# Altium schematic sheet POWERSYSTEM.SchDoc: DARKYDEN_POWERSYSTEM
size Letter; ApprovedBy: APPROUVÉ PAR; Author: Harold Malbrouck; Organization: Cegep Limoilou; Address1: 1300, 8e Avenue; Address2: Québec, QC; Address3: Canada; Address4: G1J 5L5; Revision: Rev.A; SheetNumber: 16; SheetTotal: 22
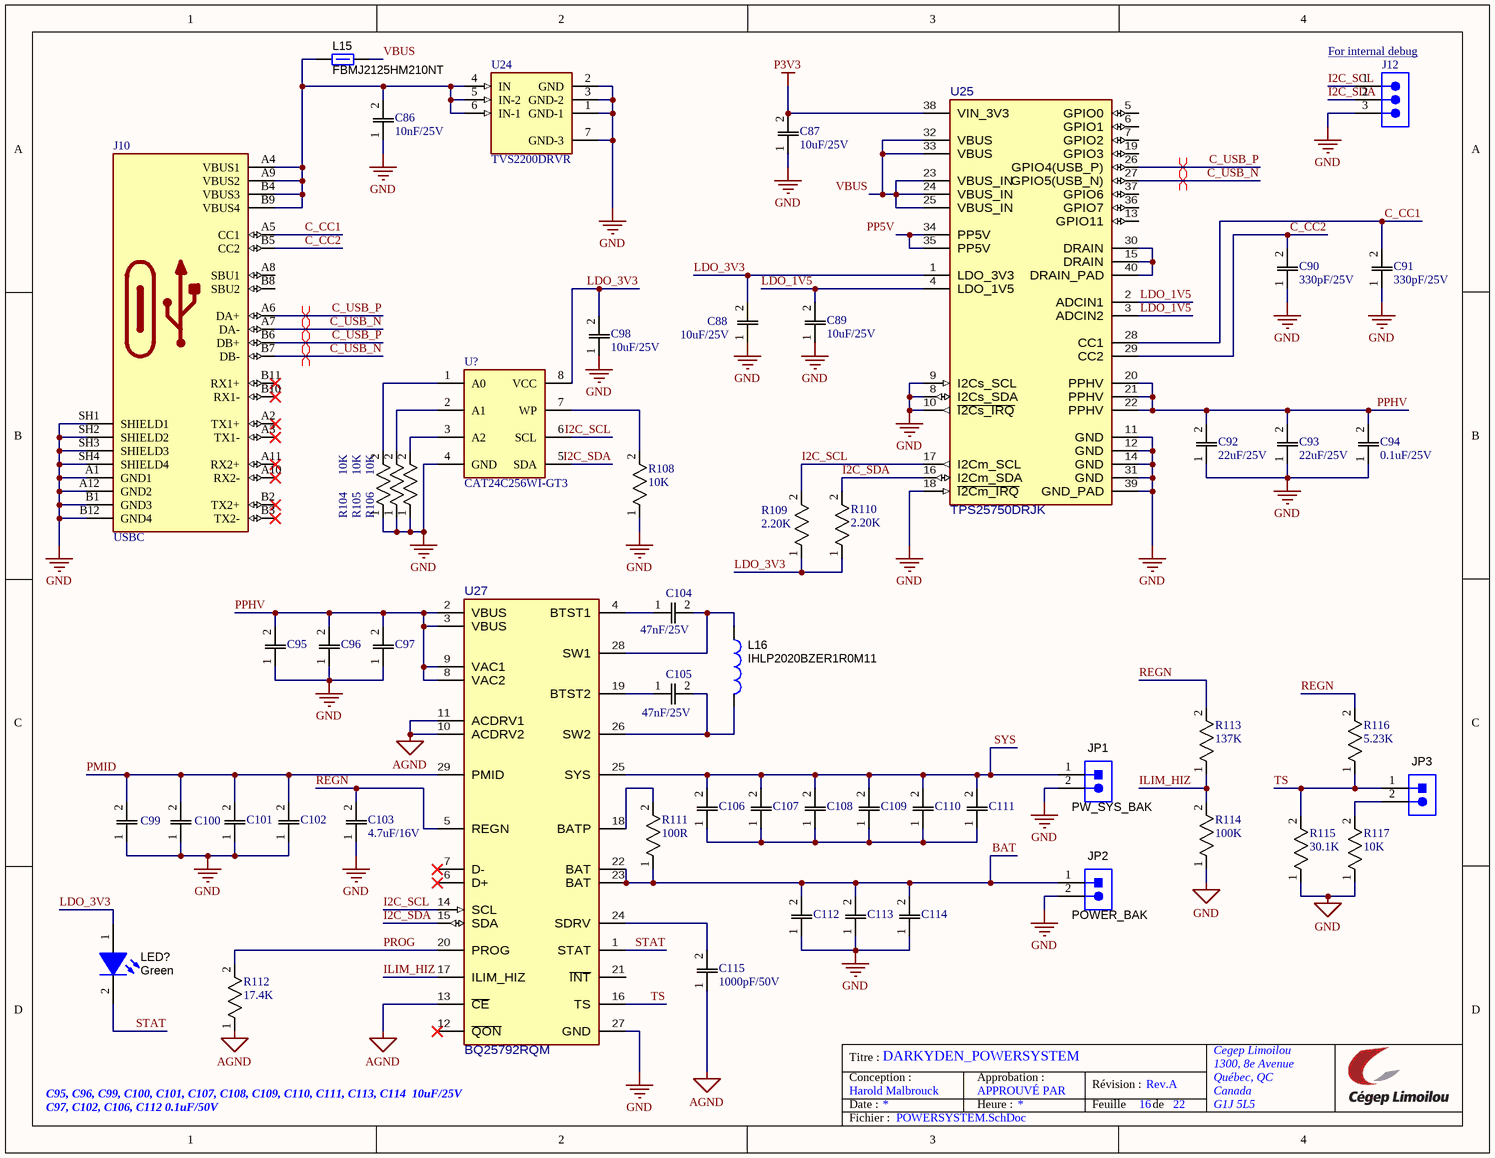
[diagram p0: POWERSYSTEM.SchDoc]

## Parts
C86  10nF/25V  [CAPC220145_88N_KEM]
C87  10uF/25V  [CAPC220145_88N_KEM]
C88  10uF/25V  [CAPC220145_88N_KEM]
C89  10uF/25V  [CAPC220145_88N_KEM]
C90  330pF/25V  [CAPC220145_88N_KEM]
C91  330pF/25V  [CAPC220145_88N_KEM]
C92  22uF/25V  [CAPC220145_88N_KEM]
C93  22uF/25V  [CAPC220145_88N_KEM]
C94  0.1uF/25V  [CAPC220145_88N_KEM]
C95  10uF/25V  [CAPC220145_88N_KEM]  (value not drawn)
C96  10uF/25V  [CAPC220145_88N_KEM]  (value not drawn)
C97  0.1uF/50V  [CAPC220145_88N_KEM]  (value not drawn)
C98  10uF/25V  [CAPC220145_88N_KEM]
C99  10uF/25V  [CAPC220145_88N_KEM]  (value not drawn)
C100  10uF/25V  [CAPC220145_88N_KEM]  (value not drawn)
C101  10uF/25V  [CAPC220145_88N_KEM]  (value not drawn)
C102  0.1uF/50V  [CAPC220145_88N_KEM]  (value not drawn)
C103  4.7uF/16V  [CAPC220145_88N_KEM]
C104  47nF/25V  [CAPC220145_88N_KEM]
C105  47nF/25V  [CAPC220145_88N_KEM]
C106  0.1uF/50V  [CAPC220145_88N_KEM]  (value not drawn)
C107  10uF/25V  [CAPC220145_88N_KEM]  (value not drawn)
C108  10uF/25V  [CAPC220145_88N_KEM]  (value not drawn)
C109  10uF/25V  [CAPC220145_88N_KEM]  (value not drawn)
C110  10uF/25V  [CAPC220145_88N_KEM]  (value not drawn)
C111  10uF/25V  [CAPC220145_88N_KEM]  (value not drawn)
C112  0.1uF/50V  [CAPC220145_88N_KEM]  (value not drawn)
C113  10uF/25V  [CAPC220145_88N_KEM]  (value not drawn)
C114  10uF/25V  [CAPC220145_88N_KEM]  (value not drawn)
C115  1000pF/50V  [CAPC220145_88N_KEM]
J10  USBC  [MOLEX_2012670005]
J12  61300311121  [61300311121]  (value not drawn)
JP1  PW_SYS_BAK  [61300211121]
JP2  POWER_BAK  [61300211121]
JP3  TS  [61300211121]  (value not drawn)
L15  FBMJ2125HM210NT  [0805_HV]
L16  IHLP2020BZER1R0M11  [IHLP-2020BZ]
LED?  value Green  [LED_LTST-C190]  (hidden comment: LTST-C190GKT)
R104  10K  [RES_0816_SUS]
R105  10K  [RES_0816_SUS]
R106  10K  [RES_0816_SUS]
R108  10K  [RES_0816_SUS]
R109  2.20K  [RES_0816_SUS]
R110  2.20K  [RES_0816_SUS]
R111  100R  [RES_0816_SUS]
R112  17.4K  [RES_0816_SUS]
R113  137K  [RES_0816_SUS]
R114  100K  [RES_0816_SUS]
R115  30.1K  [RES_0816_SUS]
R116  5.23K  [RES_0816_SUS]
R117  10K  [RES_0816_SUS]
U24  TVS2200DRVR  [SON65P200X200X80-7N]
U25  TPS25750DRJK  [TPS25750DRJKR]
U27  BQ25792RQM  [BQ25792RQMR]
U?  CAT24C256WI-GT3  [SOIC127P600X175-8N]

## Nets
AGND: C115.1 R112.1 U27.10(ACDRV2) U27.11(ACDRV1) U27.13(~{CE})
GND: C86.1 C87.1 C88.1 C89.1 C90.1 C91.1 C92.1 C93.1 C94.1 C95.1 C96.1 C97.1 C98.1 C99.1 C100.1 C101.1 C102.1 C103.1 C112.1 C113.1 C114.1 J10.A1(GND1) J10.A12(GND2) J10.B1(GND3) J10.B12(GND4) J10.SH1(SHIELD1) J10.SH2(SHIELD2) J10.SH3(SHIELD3) J10.SH4(SHIELD4) J12.3 JP1.2 JP2.2 R104.1 R105.1 R106.1 R108.1 R114.1 R115.1 R117.1 U24.1(GND-1) U24.2(GND) U24.3(GND-2) U24.7(GND-3) U25.8(I2Cs_SDA) U25.9(I2Cs_SCL) U25.10(~{I2Cs_IRQ}) U25.11(GND) U25.12(GND) U25.14(GND) U25.18(~{I2Cm_IRQ}) U25.31(GND) U25.39(GND_PAD) U27.27(GND) U?.4(GND)
P3V3: C87.2 U25.38(VIN_3V3)
BAT: C112.2 C113.2 C114.2 JP2.1 R111.1 U27.22(BAT) U27.23(BAT)
C_CC1: C91.2 J10.A5(CC1) U25.28(CC1)
C_CC2: C90.2 J10.B5(CC2) U25.29(CC2)
C_USB_N: J10.A7(DA-) J10.B7(DB-) U25.27(GPIO5(USB_N))
C_USB_P: J10.A6(DA+) J10.B6(DB+) U25.26(GPIO4(USB_P))
I2C_SCL: J12.1 R109.2 U25.17(I2Cm_SCL) U27.14(SCL) U?.6(SCL)
I2C_SDA: J12.2 R110.2 U25.16(I2Cm_SDA) U27.15(SDA) U?.5(SDA)
ILIM_HIZ: R113.1 R114.2 U27.17(ILIM_HIZ)
LDO_1V5: C89.2 U25.2(ADCIN1) U25.3(ADCIN2) U25.4(LDO_1V5)
LDO_3V3: C88.2 C98.2 LED?.1(A) R109.1 R110.1 U25.1(LDO_3V3) U?.8(VCC)
PMID: C99.2 C100.2 C101.2 C102.2 U27.29(PMID)
PP5V: U25.34(PP5V) U25.35(PP5V)
PPHV: C92.2 C93.2 C94.2 C95.2 C96.2 C97.2 U25.20(PPHV) U25.21(PPHV) U25.22(PPHV) U27.2(VBUS) U27.3(VBUS) U27.8(VAC2) U27.9(VAC1)
PROG: R112.2 U27.20(PROG)
REGN: C103.2 R113.2 R116.2 U27.5(REGN)
STAT: LED?.2(K) U27.1(STAT)
SYS: C106.2 C107.2 C108.2 C109.2 C110.2 C111.2 JP1.1 U27.25(SYS)
TS: JP3.1 R115.2 R116.1 U27.16(TS)
VBUS: L15.2 U25.23(VBUS_IN) U25.24(VBUS_IN) U25.25(VBUS_IN) U25.32(VBUS) U25.33(VBUS)
NetC86_2: C86.2 J10.A4(VBUS1) J10.A9(VBUS2) J10.B4(VBUS3) J10.B9(VBUS4) L15.1 U24.4(IN) U24.5(IN-2) U24.6(IN-1)
NetC104_1: C104.1 U27.4(BTST1)
NetC104_2: C104.2 L16.1 U27.28(SW1)
NetC105_1: C105.1 U27.19(BTST2)
NetC105_2: C105.2 L16.2 U27.26(SW2)
NetC106_1: C106.1 C107.1 C108.1 C109.1 C110.1 C111.1
NetC115_2: C115.2 U27.24(SDRV)
NetJP3_2: JP3.2 R117.2
NetR104_2: R104.2 U?.1(A0)
NetR105_2: R105.2 U?.2(A1)
NetR106_2: R106.2 U?.3(A2)
NetR108_2: R108.2 U?.7(WP)
NetR111_2: R111.2 U27.18(BATP)
NetU25_15: U25.15(DRAIN) U25.30(DRAIN) U25.40(DRAIN_PAD)

Not connected (* = marked no-connect by the designer): J10 A2(TX1+)* A3(TX1-)* A8(SBU1) A10(RX2-)* A11(RX2+)* B2(TX2+)* B3(TX2-)* B8(SBU2) B10(RX1-)* B11(RX1+)*; U25 5(GPIO0) 6(GPIO1) 7(GPIO2) 13(GPIO11) 19(GPIO3) 36(GPIO7) 37(GPIO6); U27 6(D+)* 7(D-)* 12(~{QON})* 21(~{INT})

## Layout directives
differential pair: C_USB_N, C_USB_P

## Notes on the sheet
- (near J12) For internal debug
- C95, C96, C99, C100, C101, C107, C108, C109, C110, C111, C113, C114  10uF/25V
  C97, C102, C106, C112 0.1uF/50V
- Titre :
- Conception :
- Date :
- Approbation :
- Heure :
- Révision :
- Feuille
- de
- Fichier :

## Library data of the parts
C86-C115 = Capacitor_0805: No Description Available; Mfr_Name: Yageo
J10 = USBC: USB-C (USB TYPE-C) USB 3.2 Gen 2 (USB 3.1 Gen 2, Superspeed + (USB 3.1)) Receptacle Connector 24 Position Surface Mount, Right Angle; Through Hole; MF: Molex; MP: 2012670005; SnapEDA_Link: https://www.snapeda.com/parts/2012670005/Molex/view-part/?ref=snap; Package: None; Value: *; Check_prices: https://www.snapeda.com/parts/2012670005/Molex/view-part/?ref=eda
J12 = 61300311121: WR-PHD Pin Header, THT, Vertical, pitch 2.54mm, 1 Row, 3P; Manufacturer: Wurth Elektronik; Contact Resistance: 20mOhm; Rated Current: 3A; Working Voltage: 250V; Withstanding Voltage: 500V; Manufacturer Part Number: 61300311121; Category: Board-to-Board Connectors; Match Code: WR-PHD; ComponentLink1Description: Website Link; ComponentLink1URL: https://www.we-online.com/redexpert/article/61300311121?ad; ComponentLink2Description: Datasheet Link; ComponentLink2URL: https://www.we-online.com/redexpert/spec/61300311121?ad; Mount: Through Hole; Operating Temperature Max: 105°C; Operating Temperature Min: -40°C; Packaging: Bag; Gender: Pin Header; Number of Pins: 3; Number of Rows: 1; Orientation: Vertical; Pitch: 2.54mm
JP1-JP3 = Header_2x1: Header, 100mil, 2x1, Tin, TH; PartNumber: PEC02SAAN; Manufacturer: Sullins Connector Solutions; Pitch_mm: 2.54; Gender: Male; Shrouded: N; Row_Count: 1; Current_A: 3A; Voltage_V: 1.8kV; Cert_UL: Y; CNHeader: TRUE; CT: FALSE; Green_Lifecycle: Not Set; Green_REACh: Incomplete; PackageReference: Header, 2 PIN, 100mil, Tin; CompType: Header; RoHS: Y; MountType: TH; ComponentLink1Description: Datasheet URL; ComponentLink1URL: http://www.sullinscorp.com/catalogs/77_PAGE108-109_.100_MALE_HDR.pdf; Publisher: Texas Instruments; LatestRevisionDate: 26/05/2017; Supplier 1: Digi-Key; Supplier Part Number 1: S1012E-02-ND; ClassName: Header; Orientation: Vertical; PinCount: 2; ContactFinish: Tin; Color: Black; Green_EU RoHS-2: Incomplete; Green_EU RoHS: Incomplete
L15 = CMP-0003375-1: Ferrite Bead, 21 ohm @ 100 MHz, 6 A, 0805; Manufacturer: Taiyo Yuden; ZTyp@100MHz_Ohm: 21; SizeAreaWB_mm2: 6.75; DCR_ohm: 4m; Value1: 0.004 ohm; Value: 21 ohm; Imax_A: 6A; SizeZ_mm: 1.45; SizeX_mm: 2; SizeY_mm: 1.25; SizeArea_mm2: 2.5; ComponentLink1URL: http://www.yuden.co.jp/us/product/pdf/efbm_e.pdf; Publisher: Texas Instruments; Published: 2014-04-30; RoHS: Y; MountType: SMT; Supplier 1: Digi-Key; PackageReference: 0805; Value2: 6A; CompType: Ferrite Bead; LatestRevisionDate: 2017-03-09; PartNumber: FBMJ2125HM210NT; ComponentLink1Description: Datasheet link; Supplier Part Number 1: 587-1765-1-ND; ValueDisplayed: 21 ohm
L16 = IHLP2020BZER1R0M11: Inductor, Shielded Drum Core, Powdered Iron, 1 uH, 7 A, 0.0181 ohm, SMD; Manufacturer: Vishay-Dale; Isat: 7A @ 20% inductance drop; Irms: 7.5A @ 40C rise; Green_Lifecycle: Active; SizeAreaWB_mm2: 53.7782; DCR_ohm: 0.0181; Green_REACh: Passed; Value: 1uH; Imax_A: 7A; SizeZ_mm: 2; SizeX_mm: 5.49; SizeY_mm: 5.18; SizeArea_mm2: 28.4382; Ind_H: 1µH; AEC Category: Q200; ComponentLink1URL: http://www.vishay.com/docs/34261/lp20bz11.pdf; Publisher: Texas Instruments; Published: 2008-06-26; RoHS: Y; Value1: 0.0181 ohm; Material: Powdered Iron; MountType: SMT; Green_EU RoHS-2: Passed; Supplier 1: Digi-Key; Green_EU RoHS: Passed; PackageReference: 5.49x2x5.18mm; Value2: 7A; CompType: Inductor; LatestRevisionDate: 2017-06-02; PartNumber: IHLP2020BZER1R0M11; AEC Qualified: ?; ComponentLink1Description: Datasheet link; Supplier Part Number 1: 541-1218-1-ND; Technology: Shielded Drum Core
LED? = LED_Gr_SMD: LED, Green, SMD; Manufacturer: Lite-On; Vf_V: 2.1V; Io_A: 20mA; Power_TotalModule: 100mW; Value1: 0.1W; CompType: LED; PartNumber: LTST-C190GKT; MountType: SMT; RoHS: Y; PackageReference: 1.6x0.8x0.8mm; Type: ?; Value2: 2.1V; Color: green; ComponentLink1URL: https://sps06.itg.ti.com/sites/KMS/crossdivteams/altium/docs/ComponentDatasheets/LTST-C190GKT.pdf; ComponentLink1Description: Datasheet link
R104-R106 R108-R117 = RG1608P-104-B-T5: No Description Available; Mfr_Name: Susumu
U24 = TVS2200DRVR: ESD Suppressors / TVS Diodes 22V flat-clamp surge protection device 6-WSON -40 to 125; MF: Texas Instruments; Number of Channels: 1; Clamping Voltage: 28V; Direction: Unidirectional; Breakdown Voltage: 24.6V; Peak Pulse Current: 40A; SnapEDA_Link: https://www.snapeda.com/parts/TVS2200DRVR/Texas+Instruments/view-part/?ref=snap; Package: WSON-6 Texas Instruments; Value: *; MP: TVS2200DRVR; Check_prices: https://www.snapeda.com/parts/TVS2200DRVR/Texas+Instruments/view-part/?ref=eda; Supplier: Digikey; Supplier Part Number: 296-52187-1-ND; Manufacturer: Texas Instruments; Manufacturer Part Number: TVS2200DRVR; RoHS: Yes; Category: ESD and Circuit Protection ICs; Stock: 5934; Pricing: 1=0.54, 10=0.373, 100=0.254, 500=0.199, 1000=0.181 (USD); Mounting Technology: Surface Mount; Pins: 6; Min Operating Temperature: -40°C; Max Operating Temperature: 125°C; Packaging: Cut Tape; Number of Circuits: 1; Series: -; Reverse Standoff Voltage: 22V; Length: 2mm; Width: 2mm; Height: 800um; Thickness: 750um; RoHS Compliant: Yes; ComponentLink1URL: http://www.ti.com/general/docs/suppproductinfo.tsp?distId=10&amp;gotoUrl=http%3A%2F%2Fwww.ti.com%2Flit%2Fgpn%2Ftvs2200&src-supplier=Digikey; ComponentLink1Description: http://www.ti.com/general/docs/suppproductinfo.tsp?distId=10&amp;gotoUrl=http%3A%2F%2Fwww.ti.com%2Flit%2Fgpn%2Ftvs2200&src-supplier=Digikey; ComponentLink2URL: http://www.ti.com/lit/ds/symlink/tvs2200.pdf?src-supplier=Digikey; ComponentLink2Description: http://www.ti.com/lit/ds/symlink/tvs2200.pdf?src-supplier=Digikey
U25 = TPS25750DRJK: USB Type-C and USB PD Controller with Integrated Power Switches Optimized for Power Applications; Manufacturer: Texas Instruments; CompType: IC; Usb Standard: USB 3.0; AEC Category: Q200; SizeZ_mm: 0.8mm; Standoff Height: 0mm; AEC Qualified: No; Max Supply Voltage: 22V; TaMax_C: +105°C; Min Supply Voltage: 3V; TaMin_C: -40°C; TJmax_C: +175°C; Number Of Ports: 1; RoHS: UNKNOWN; Part Number: TPS25750DRJK; ComponentLink3URL: http://www.ti.com/product/GPN/datasheet; helpURL: https://upverter.com/upn/revision/5be88369cac593dc/; ComponentLink1URL: http://www.ti.com/lit/ds/symlink/GPN.pdf; PackageReference: VQFN32; ComponentLink1Description: Datasheet Link; ComponentLink2URL: http://www.ti.com/product/GPN; Operating Temperature Range: -40°C to +125°C; Datasheet Path: datasheets/IC-TPS25750DRJK.pdf; ComponentLink2Description: Product Folder; ComponentLink3Description: Online Datasheet
U27 = BQ2579x: BQ2579x HotRod; Manufacturer: Texas Instruments; SizeZ_mm: 1mm; Standoff Height: 0mm; helpURL: https://upverter.com/upn/revision/94d0648e55e6c5c0/; Operating Temperature Range: to; Part Number: BQ25792RQM; Datasheet Path: datasheets/IC-BQ25792RQM.pdf; PackageReference: VQFN-HR29; RoHS: UNKNOWN
U? = CAT24C256WI-GT3: EEPROM Memory IC 256Kbit I2C 1 MHz 500 ns 8-SOIC; Manufacturer_Name: onsemi; Description: Supports Standard; Datasheet Link: https://www.onsemi.com/pub/Collateral/CAT24C256-D.PDF; Height: 1.75mm; Manufacturer_Part_Number: CAT24C256WI-GT3; Mouser Part Number: 698-CAT24C256WI-GT3; Mouser Price/Stock: https://www.mouser.co.uk/ProductDetail/onsemi/CAT24C256WI-GT3?qs=rZgeL6XvLwaEqwp5Dppodg%3D%3D; Arrow Part Number: CAT24C256WI-GT3; Arrow Price/Stock: https://www.arrow.com/en/products/cat24c256wi-gt3/on-semiconductor?utm_currency=USD&region=nac